# Altium schematic sheet DAC.SchDoc
size A4; SheetNumber: 3; SheetTotal: 4
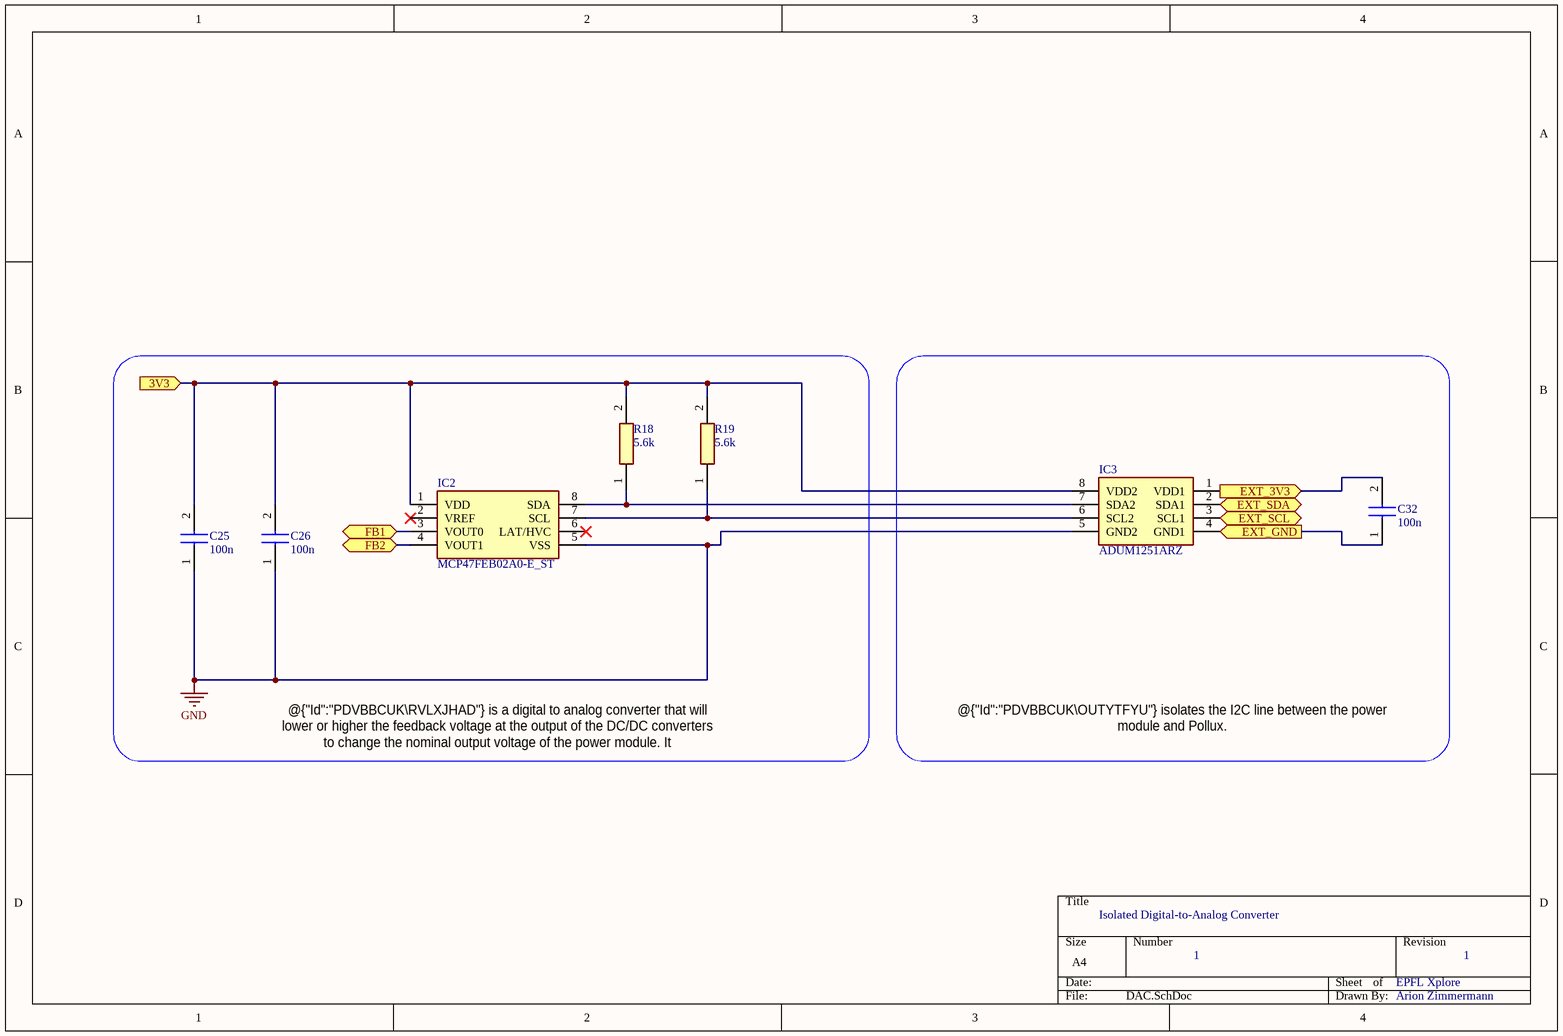
[diagram p0: DAC.SchDoc]

## Parts
C25  value 100n  [CAPC1608X95N]  (hidden comment: C0603C104K5RACTU)
C26  value 100n  [CAPC1608X95N]  (hidden comment: C0603C104K5RACTU)
C32  value 100n  [CAPC1608X95N]  (hidden comment: C0603C104K5RACTU)
IC2  MCP47FEB02A0-E_ST  [SOP65P640X120-8N]
IC3  ADUM1251ARZ  [SOIC127P600X175-8N]
R18  value 5.6k  [RESC1608X50N]  (hidden comment: CRCW06035K60JNEAC)
R19  value 5.6k  [RESC1608X50N]  (hidden comment: CRCW06035K60JNEAC)

## Ports
3V3 (in), EXT_3V3 (in), EXT_GND (out), EXT_SCL (bidir), EXT_SDA (bidir), FB1 (bidir), FB2 (bidir)

## Nets
GND: C25.1 C26.1 IC2.5(VSS) IC3.5(GND2)
3V3: C25.2 C26.2 IC2.1(VDD) IC3.8(VDD2) R18.2 R19.2 ; port 3V3
EXT_3V3: C32.2 IC3.1(VDD1) ; port EXT_3V3
EXT_GND: C32.1 IC3.4(GND1) ; port EXT_GND
EXT_SCL: IC3.3(SCL1) ; port EXT_SCL
EXT_SDA: IC3.2(SDA1) ; port EXT_SDA
FB1: IC2.3(VOUT0) ; port FB1
FB2: IC2.4(VOUT1) ; port FB2
NetIC2_7: IC2.7(SCL) IC3.6(SCL2) R19.1
NetIC2_8: IC2.8(SDA) IC3.7(SDA2) R18.1

Not connected (* = marked no-connect by the designer): IC2 2(VREF)* 6(LAT/HVC)*

## Notes on the sheet
- @{"Id":"PDVBBCUK\RVLXJHAD"} is a digital to analog converter that will lower or higher the feedback voltage at the output of the DC/DC converters to change the nominal output voltage of the power module. It communicates with I2C to Pollux.
- @{"Id":"PDVBBCUK\OUTYTFYU"} isolates the I2C line between the power module and Pollux.
- Isolated Digital-to-Analog Converter
- 1
- EPFL Xplore
- Arion Zimmermann

## Library data of the parts
C25 C26 C32 = C0603C104K5RACTU: Capacitor; Manufacturer_Name: Kemet; Datasheet Link: http://www.farnell.com/datasheets/2205446.pdf; Height: 0.95mm; Manufacturer_Part_Number: C0603C104K5RACTU; Mouser Part Number: 80-C0603C104K5R; Mouser Price/Stock: https://www.mouser.co.uk/ProductDetail/KEMET/C0603C104K5RACTU?qs=l5k%252BbMnNDkkVcnZPSAaaiQ%3D%3D; Arrow Part Number: C0603C104K5RACTU; Arrow Price/Stock: https://www.arrow.com/en/products/c0603c104k5ractu/kemet-corporation; Supplier 1: Mouser; Supplier Part Number 1: 80-C0603C104K5R
IC2 = MCP47FEB02A0-E_ST: Integrated Circuit; Manufacturer_Name: Microchip; Manufacturer_Part_Number: MCP47FEB02A0-E/ST; Datasheet Link: http://www.microchip.com/mymicrochip/filehandler.aspx?ddocname=en573220; Height: 1.2mm; Mouser Part Number: 579-MCP47FEB02A0EST; Mouser Price/Stock: https://www.mouser.co.uk/ProductDetail/Microchip-Technology/MCP47FEB02A0-E-ST?qs=rQCxX1QmdjKDJonwz1QvmA%3D%3D; Arrow Part Number: MCP47FEB02A0-E/ST; Arrow Price/Stock: https://www.arrow.com/en/products/mcp47feb02a0-est/microchip-technology?region=nac
IC3 = ADUM1251ARZ: Integrated Circuit; Manufacturer_Name: Analog Devices; Datasheet Link: https://datasheet.datasheetarchive.com/originals/distributors/Datasheets-DGA3/264898.pdf; Height: 1.75mm; Manufacturer_Part_Number: ADUM1251ARZ; Mouser Part Number: 584-ADUM1251ARZ; Mouser Price/Stock: https://www.mouser.co.uk/ProductDetail/Analog-Devices/ADUM1251ARZ?qs=WIvQP4zGani5W7Ldr0QsZA%3D%3D; Arrow Part Number: ADUM1251ARZ; Arrow Price/Stock: https://www.arrow.com/en/products/adum1251arz/analog-devices?region=nac; Supplier 1: Mouser; Supplier Part Number 1: 584-ADUM1251ARZ
R18 R19 = CRCW06035K62FKEB: Resistor; Manufacturer_Name: Vishay; Datasheet Link: http://www.vishay.com/docs/20035/dcrcwe3.pdf; Height: 0.5mm; Manufacturer_Part_Number: CRCW06035K62FKEB; Mouser Part Number: 71-CRCW06035K62FKEB; Mouser Price/Stock: https://www.mouser.co.uk/ProductDetail/Vishay-Dale/CRCW06035K62FKEB?qs=P6ImCWcZKGBvDktlVJxa7w%3D%3D; Supplier 1: Mouser; Supplier Part Number 1: 71-CRCW06035K60JNEAC